# EAGLE design 7segement2digits1badidea-mk-6.0 (EAGLE 6.5.0)
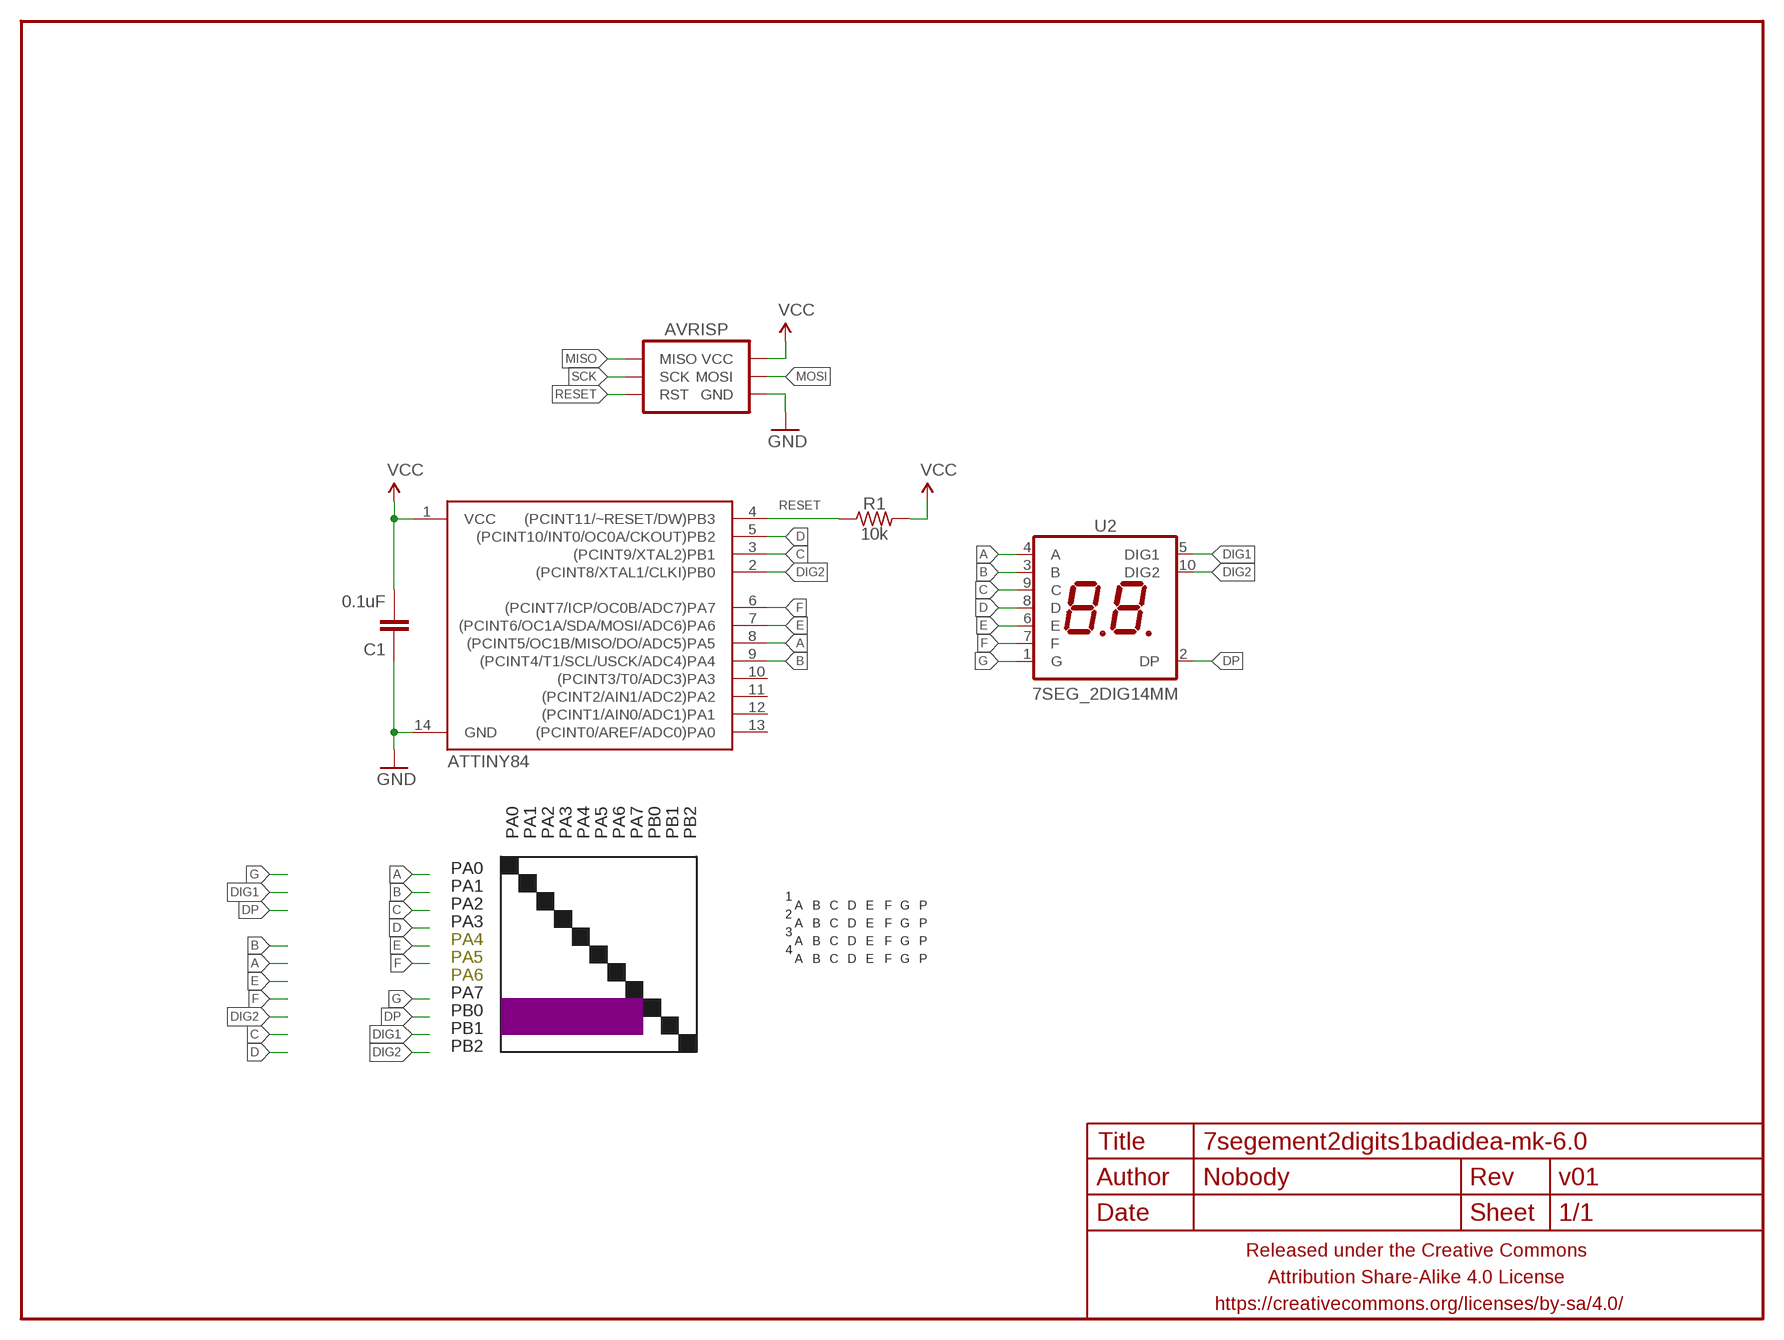
[diagram p0: schematic, sheet 1]

## Parts
AVRISP  AVR_SPI_PRG_62X3_SMD  [2X3_SMD]
C1  0.1uF  CAPACITOR-CERAMICC0603  [C0603]
FRAME1  FRAME-LETTERNO_PACKAGE  [DUMMY]
R1  10k  RESISTORR0603  [R0603]
U1  ATTINY84  [SO14]
U2  7SEG_2DIG14MM  [7SEG_2DIG_14MM]

## Nets
A: U1.8((PCINT5/OC1B/MISO/DO/ADC5)PA5) U2.4(A)
B: U1.9((PCINT4/T1/SCL/USCK/ADC4)PA4) U2.3(B)
C: U1.3((PCINT9/XTAL2)PB1) U2.9(C)
D: U1.5((PCINT10/INT0/OC0A/CKOUT)PB2) U2.8(D)
DIG1: U2.5(DIG1)
DIG2: U1.2((PCINT8/XTAL1/CLKI)PB0) U2.10(DIG2)
DP: U2.2(DP)
E: U1.7((PCINT6/OC1A/SDA/MOSI/ADC6)PA6) U2.6(E)
F: U1.6((PCINT7/ICP/OC0B/ADC7)PA7) U2.7(F)
G: U2.1(G)
GND: AVRISP.6(GND) C1.1 U1.14(GND)
MISO: AVRISP.1(MISO)
MOSI: AVRISP.4(MOSI)
RESET: AVRISP.5(RST) R1.1 U1.4((PCINT11/~RESET/DW)PB3)
SCK: AVRISP.3(SCK)
VCC: AVRISP.2(VCC) C1.2 R1.2 U1.1(VCC)
Unconnected: U1.10((PCINT3/T0/ADC3)PA3) U1.11((PCINT2/AIN1/ADC2)PA2) U1.12((PCINT1/AIN0/ADC1)PA1) U1.13((PCINT0/AREF/ADC0)PA0)

## Notes on the sheet
- PA0 | PA1 | PA2 | PA3 | PA4 | PA5 | PA6 | PA7 | PB0 | PB1 | PB2
- PA0
- PA1 | 1
- PA2 | 2 | A | B | C | D | E | F | G | P
- PA3 | 3 | A | B | C | D | E | F | G | P
- PA4 | 4 | A | B | C | D | E | F | G | P
- PA5 | A | B | C | D | E | F | G | P
- PA6
- PA7 | 1
- PB0 | 2 | A | B | C | D | E | F | G | P
- PB1 | A | B | C | D | E | F | G | P
- PB2

## Library data of the parts
AVRISP = A_butts:AVR_SPI_PRG_6: AVR ISP 6 Pin This is the reduced ISP connector for AVR programming. Common on Arduino. This footprint will take up less PCB space and can be used with a 10-pin to 6-pin adapter such as SKU: BOB-08508 **Special note about "TEST_POINT" package. The stop mask is on the top side, so if you want your programming test points to be on the bottom of your board, make sure to place this package on the bottom side of the board. This also ensure that the orientation to program from the bottom side will be correct.
C1 = A_butts:CAPACITOR-CERAMIC: CAPACITOR, European symbol
FRAME1 = A_butts:FRAME-LETTER: Schematic Frame Standard 8.5x11 US Letter frame; DESIGNER: Nobody; VERSION: v01
R1 = A_butts:RESISTOR: RESISTOR, American symbol
U1 = A_butts:ATTINY84: Atmel 14-pin 2/4/8kB flash uC
U2 = A_butts:7SEG_2DIG

## Board
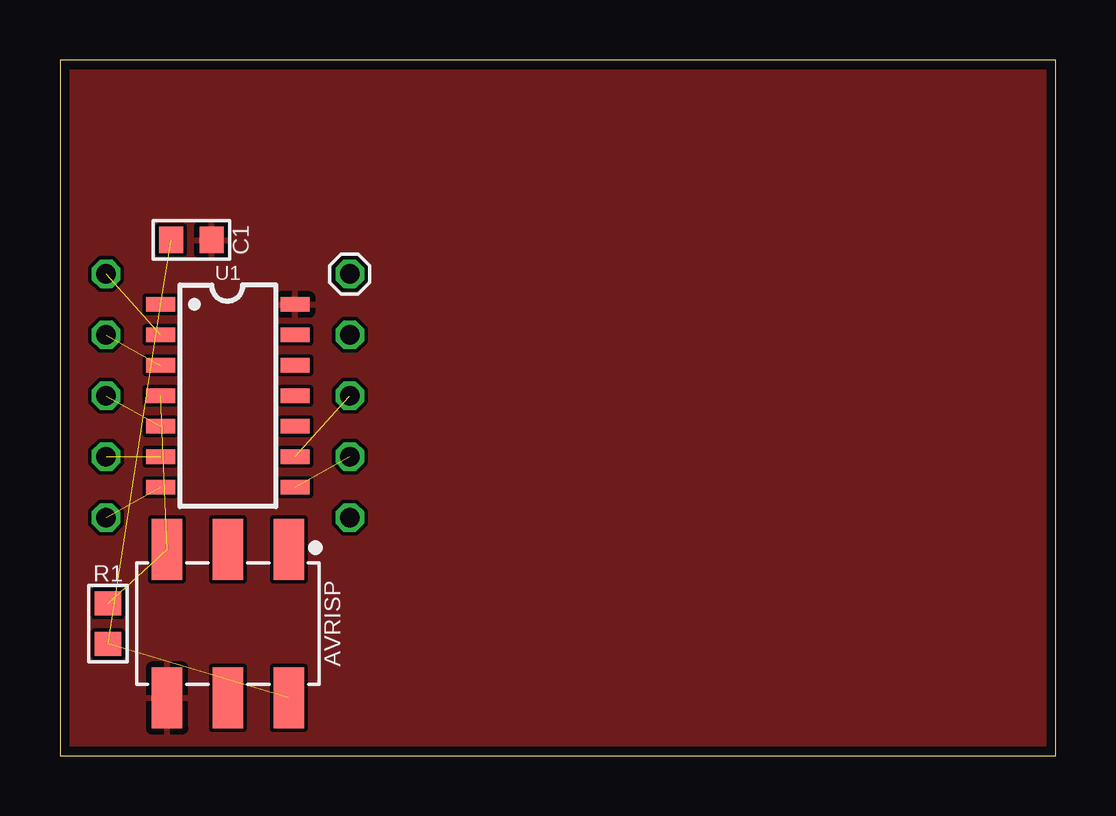
[diagram p1: board, top side]
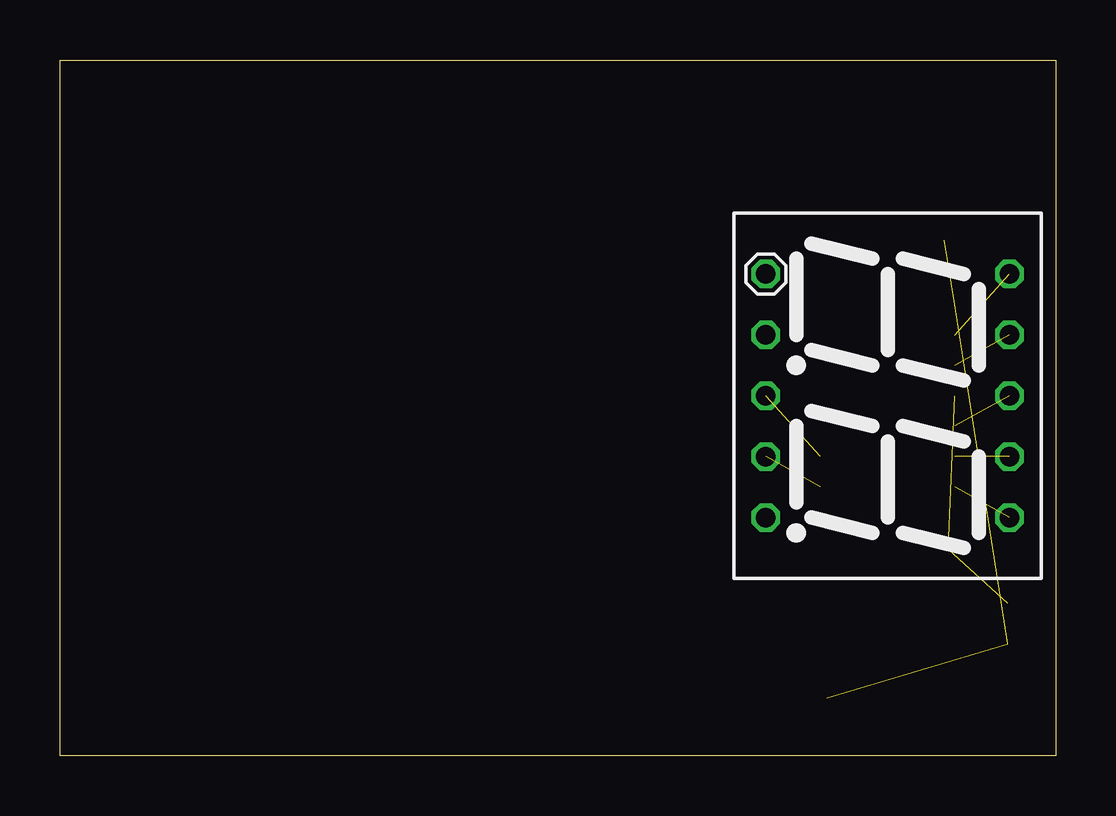
[diagram p2: board, bottom side, seen from below]

Size 41.5 x 29 mm. Coordinates in mm from the lower left corner, seen from the top.
Outline: 0,29 0,0 41.5,0 41.5,29 0,29
Copper layers (1*16): Top 0.0356mm / dielectric 1.5011mm / Bottom 0.0356mm
Design rules "LaenPCBOrder_2": minimum track width 6mil, minimum drill 13mil, track to track 6mil, track to pad 6mil, pad to pad 6mil, via to via 6mil, smd to smd 6mil, copper to edge 15mil, drill to drill 6mil, minimum pad ring 7mil, minimum via ring 7mil, stop-mask expansion 3mil, vias tented up to drill 20mil, thermal gap 10mil

### Footprints (pad centres in the part's own frame; a part is rotated, then mirrored left to right if it is on the bottom)
2X3_SMD = smd 1.27 x 2.54: 1 -2.54,-3.1; 2 -2.54,3.1; 3 0,-3.1; 4 0,3.1; 5 2.54,-3.1; 6 2.54,3.1
C0603 = smd 1 x 1.1: 1 -0.85,0; 2 0.85,0
R0603 = smd 1 x 1.1: 1 -0.85,0; 2 0.85,0
SO14 = smd 0.6 x 1.2: 1 -3.81,-2.8; 2 -2.54,-2.8; 3 -1.27,-2.8; 4 0,-2.8; 5 1.27,-2.8; 6 2.54,-2.8; 7 3.81,-2.8; 8 3.81,2.8; 9 2.54,2.8; 10 1.27,2.8; 11 0,2.8; 12 -1.27,2.8; 13 -2.54,2.8; 14 -3.81,2.8
7SEG_2DIG_14MM = drill 0.8 octagon: 1 -5.08,-5.08; 2 -2.54,-5.08; 3 0,-5.08; 4 2.54,-5.08; 5 5.08,-5.08; 6 5.08,5.08; 7 2.54,5.08; 8 0,5.08; 9 -2.54,5.08; 10 -5.08,5.08

### Placement (x,y rotation side)
AVRISP  7,5.5 180 top
C1  5.48,21.5 180 top
FRAME1  0,-0.5 0 top
R1  2,5.5 270 top
U1  7,15 270 top
U2  7,15 270 bottom

### Tracks (layer width: path | path; a pad name or v marks a point on that pad's centre or on a via)
A  (1 unrouted)
B  (1 unrouted)
C  (1 unrouted)
D  (1 unrouted)
DIG2  (1 unrouted)
E  (1 unrouted)
F  (1 unrouted)
GND
  pour Top: 0,0 0,29 41.5,29 41.5,0
RESET  (2 unrouted)
VCC  (3 unrouted)